# Altium schematic sheet 4_USB.SchDoc: Title
size 420 x 297 mm; Address1: Address1; Address2: Address2; Address3: Address3; Address4: Address4; SheetNumber: 1; Scale: 1:1; Title2str: Title2str; DocumentType: Схема электрическая принципиальная
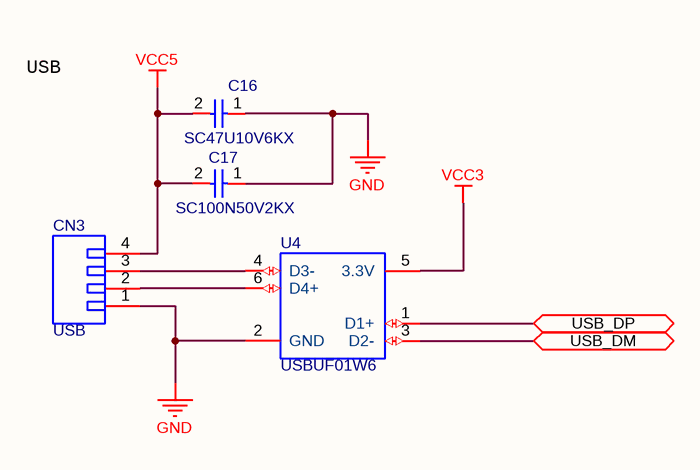
[diagram p0: 4_USB.SchDoc]

## Parts
C16  SC47U10V6KX  [CAPC1206(3216)]
C17  SC100N50V2KX  [CAPC0402(1005)60_L]
CN3  USB  [4PHEADERS-2D54]
U4  USBUF01W6  [SOT323-6L]

## Ports
USB_DM (bidir), USB_DP (bidir)

## Nets
GND: C16.1 C17.1 CN3.1 U4.2(GND)
VCC3: U4.5(3.3V)
VCC5: C16.2 C17.2 CN3.4
USB_DM: U4.3(D2-) ; port USB_DM
USB_DP: U4.1(D1+) ; port USB_DP
NetCN3_2: CN3.2 U4.6(D4+)
NetCN3_3: CN3.3 U4.4(D3-)

## Notes on the sheet
- USB
- Перв. примен.
- Справ. №
- Подп. и дата
- Инв. № дубл.
- Взам. инв. №
- Разраб.
- Изм.
- Лист
- № докум.
- Подп.
- Дата
- Лит.
- Масса
- Масштаб
- Пров.
- Т.контр.
- Листов
- Инв. № подл.
- Утв.
- Н.контр.
- 2.106-A3
- Копировал
- Формат А3

## Library data of the parts
C16 = CAP(1206)47UF10V: CAP 47uF 10V ±10% 1206(3216 Metric) Thickness 1.8mm SMD
C17 = CAP(0402)100nF50V: CAP 100nF 50V ±10% 0402 (1005 Metric) Thickness 0.6mm SMD
CN3 = 4PIN-CN: 4 holes for 18awg wire; Manufacturer: JST; Datasheet URL: http://www.jst-mfg.com/product/pdf/eng/eGH.pdf; Package Reference: JST-BM04B-GHS-TBT